# Altium schematic sheet [5] Connectors.SchDoc
size A4
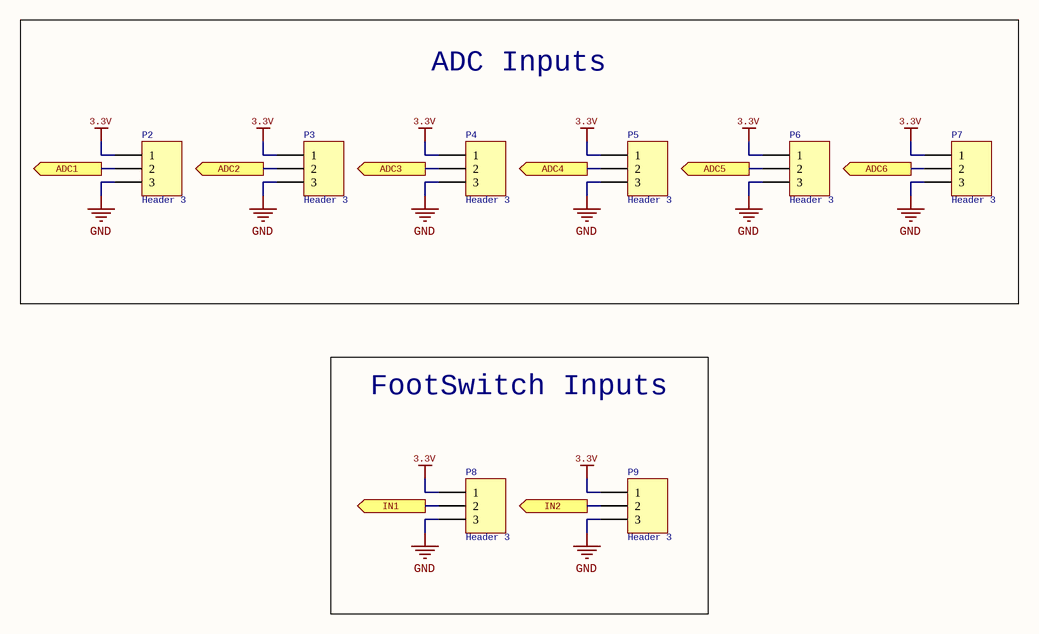
[diagram p0: [5] Connectors.SchDoc]

## Parts
P2  Header 3  [HDR1X3]  (no BOM)
P3  Header 3  [HDR1X3]  (no BOM)
P4  Header 3  [HDR1X3]  (no BOM)
P5  Header 3  [HDR1X3]  (no BOM)
P6  Header 3  [HDR1X3]  (no BOM)
P7  Header 3  [HDR1X3]  (no BOM)
P8  Header 3  [HDR1X3]  (no BOM)
P9  Header 3  [HDR1X3]  (no BOM)

## Blocks framed on the sheet
ADC Inputs: P2-P7
FootSwitch Inputs: P8 P9

## Ports
ADC1 (out), ADC2 (out), ADC3 (out), ADC4 (out), ADC5 (out), ADC6 (out), IN1 (out), IN2 (out)

## Nets
3.3V: P2.1 P3.1 P4.1 P5.1 P6.1 P7.1 P8.1 P9.1
GND: P2.3 P3.3 P4.3 P5.3 P6.3 P7.3 P8.3 P9.3
ADC1: P2.2 ; port ADC1
ADC2: P3.2 ; port ADC2
ADC3: P4.2 ; port ADC3
ADC4: P5.2 ; port ADC4
ADC5: P6.2 ; port ADC5
ADC6: P7.2 ; port ADC6
IN1: P8.2 ; port IN1
IN2: P9.2 ; port IN2

## Library data of the parts
P2-P9 = Header 3: Header, 3-Pin; LatestRevisionDate: 17-Jul-2002; LatestRevisionNote: Re-released for DXP Platform.; Publisher: Altium Limited